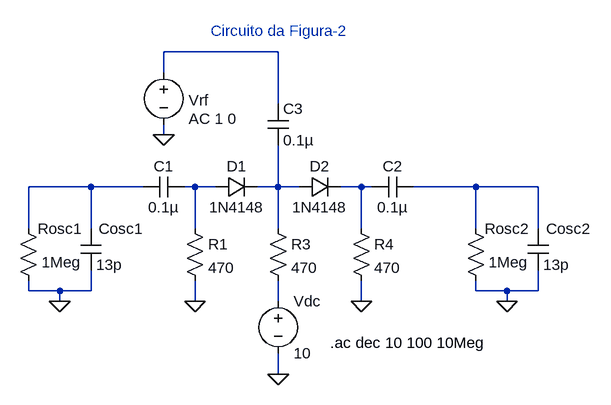
[diagram p0: schematic Chave_RF_2.asc]
Chave_RF_2.asc, the LTspice schematic file:
Version 4
SHEET 1 880 680
WIRE 160 -32 -16 -32
WIRE -16 0 -16 -32
WIRE 160 48 160 -32
WIRE -16 96 -16 80
WIRE -128 176 -224 176
WIRE -48 176 -128 176
WIRE 32 176 16 176
WIRE 64 176 32 176
WIRE 160 176 160 112
WIRE 160 176 128 176
WIRE 192 176 160 176
WIRE 288 176 256 176
WIRE 304 176 288 176
WIRE 464 176 368 176
WIRE 560 176 464 176
WIRE -224 240 -224 176
WIRE -128 240 -128 176
WIRE 32 240 32 176
WIRE 160 240 160 176
WIRE 288 240 288 176
WIRE 464 240 464 176
WIRE 560 240 560 176
WIRE -224 336 -224 320
WIRE -176 336 -224 336
WIRE -128 336 -128 304
WIRE -128 336 -176 336
WIRE 464 336 464 320
WIRE 512 336 464 336
WIRE 560 336 560 304
WIRE 560 336 512 336
WIRE -176 352 -176 336
WIRE 32 352 32 320
WIRE 160 352 160 320
WIRE 288 352 288 320
WIRE 512 352 512 336
WIRE 160 464 160 432
FLAG 160 464 0
FLAG 288 352 0
FLAG 512 352 0
FLAG 32 352 0
FLAG -16 96 0
FLAG -176 352 0
SYMBOL diode 192 192 R270
WINDOW 0 32 32 VTop 2
WINDOW 3 0 32 VBottom 2
SYMATTR InstName D2
SYMATTR Value 1N4148
SYMBOL cap -48 192 R270
WINDOW 0 32 32 VTop 2
WINDOW 3 0 32 VBottom 2
SYMATTR InstName C1
SYMATTR Value 0.1µ
SYMBOL cap 304 192 R270
WINDOW 0 32 32 VTop 2
WINDOW 3 0 32 VBottom 2
SYMATTR InstName C2
SYMATTR Value 0.1µ
SYMBOL voltage -16 -16 R0
WINDOW 0 38 59 Left 2
WINDOW 123 38 87 Left 2
SYMATTR InstName Vrf
SYMATTR Value ""
SYMATTR Value2 AC 1 0
SYMATTR SpiceLine Rser=0
SYMBOL res 144 224 R0
SYMATTR InstName R3
SYMATTR Value 470
SYMBOL voltage 160 336 R0
WINDOW 123 0 0 Left 0
WINDOW 39 0 0 Left 0
SYMATTR InstName Vdc
SYMATTR Value 10
SYMBOL res 272 224 R0
SYMATTR InstName R4
SYMATTR Value 470
SYMBOL res 448 224 R0
WINDOW 0 30 16 Left 2
WINDOW 3 36 68 Left 2
SYMATTR InstName Rosc2
SYMATTR Value 1Meg
SYMBOL cap 544 240 R0
WINDOW 0 28 0 Left 2
SYMATTR InstName Cosc2
SYMATTR Value 13p
SYMBOL diode 64 192 R270
WINDOW 0 32 32 VTop 2
WINDOW 3 0 32 VBottom 2
SYMATTR InstName D1
SYMATTR Value 1N4148
SYMBOL res 16 224 R0
SYMATTR InstName R1
SYMATTR Value 470
SYMBOL cap 144 48 R0
SYMATTR InstName C3
SYMATTR Value 0.1µ
SYMBOL res -240 224 R0
WINDOW 0 30 16 Left 2
WINDOW 3 36 68 Left 2
SYMATTR InstName Rosc1
SYMATTR Value 1Meg
SYMBOL cap -144 240 R0
WINDOW 0 28 0 Left 2
SYMATTR InstName Cosc1
SYMATTR Value 13p
TEXT 240 416 Left 2 !.ac dec 10 100 10Meg
TEXT 56 -64 Left 2 ;Circuito da Figura-2

The netlist it stands for:
* Chave_RF_2.asc
D2 N004 N005 1N4148
C1 N002 N003 0.1µ
C2 N005 N006 0.1µ
Vrf N001 0 AC 1 0 Rser=0
R3 N004 N007 470
Vdc N007 0 10
R4 N005 0 470
Rosc2 N006 0 1Meg
Cosc2 N006 0 13p
D1 N003 N004 1N4148
R1 N003 0 470
C3 N001 N004 0.1µ
Rosc1 N002 0 1Meg
Cosc1 N002 0 13p
.model D D
.lib standard.dio
.ac dec 10 100 10Meg
* Circuito da Figura-2
.backanno
.end